# EAGLE design FINAL PROJECT (EAGLE 9.6.2)
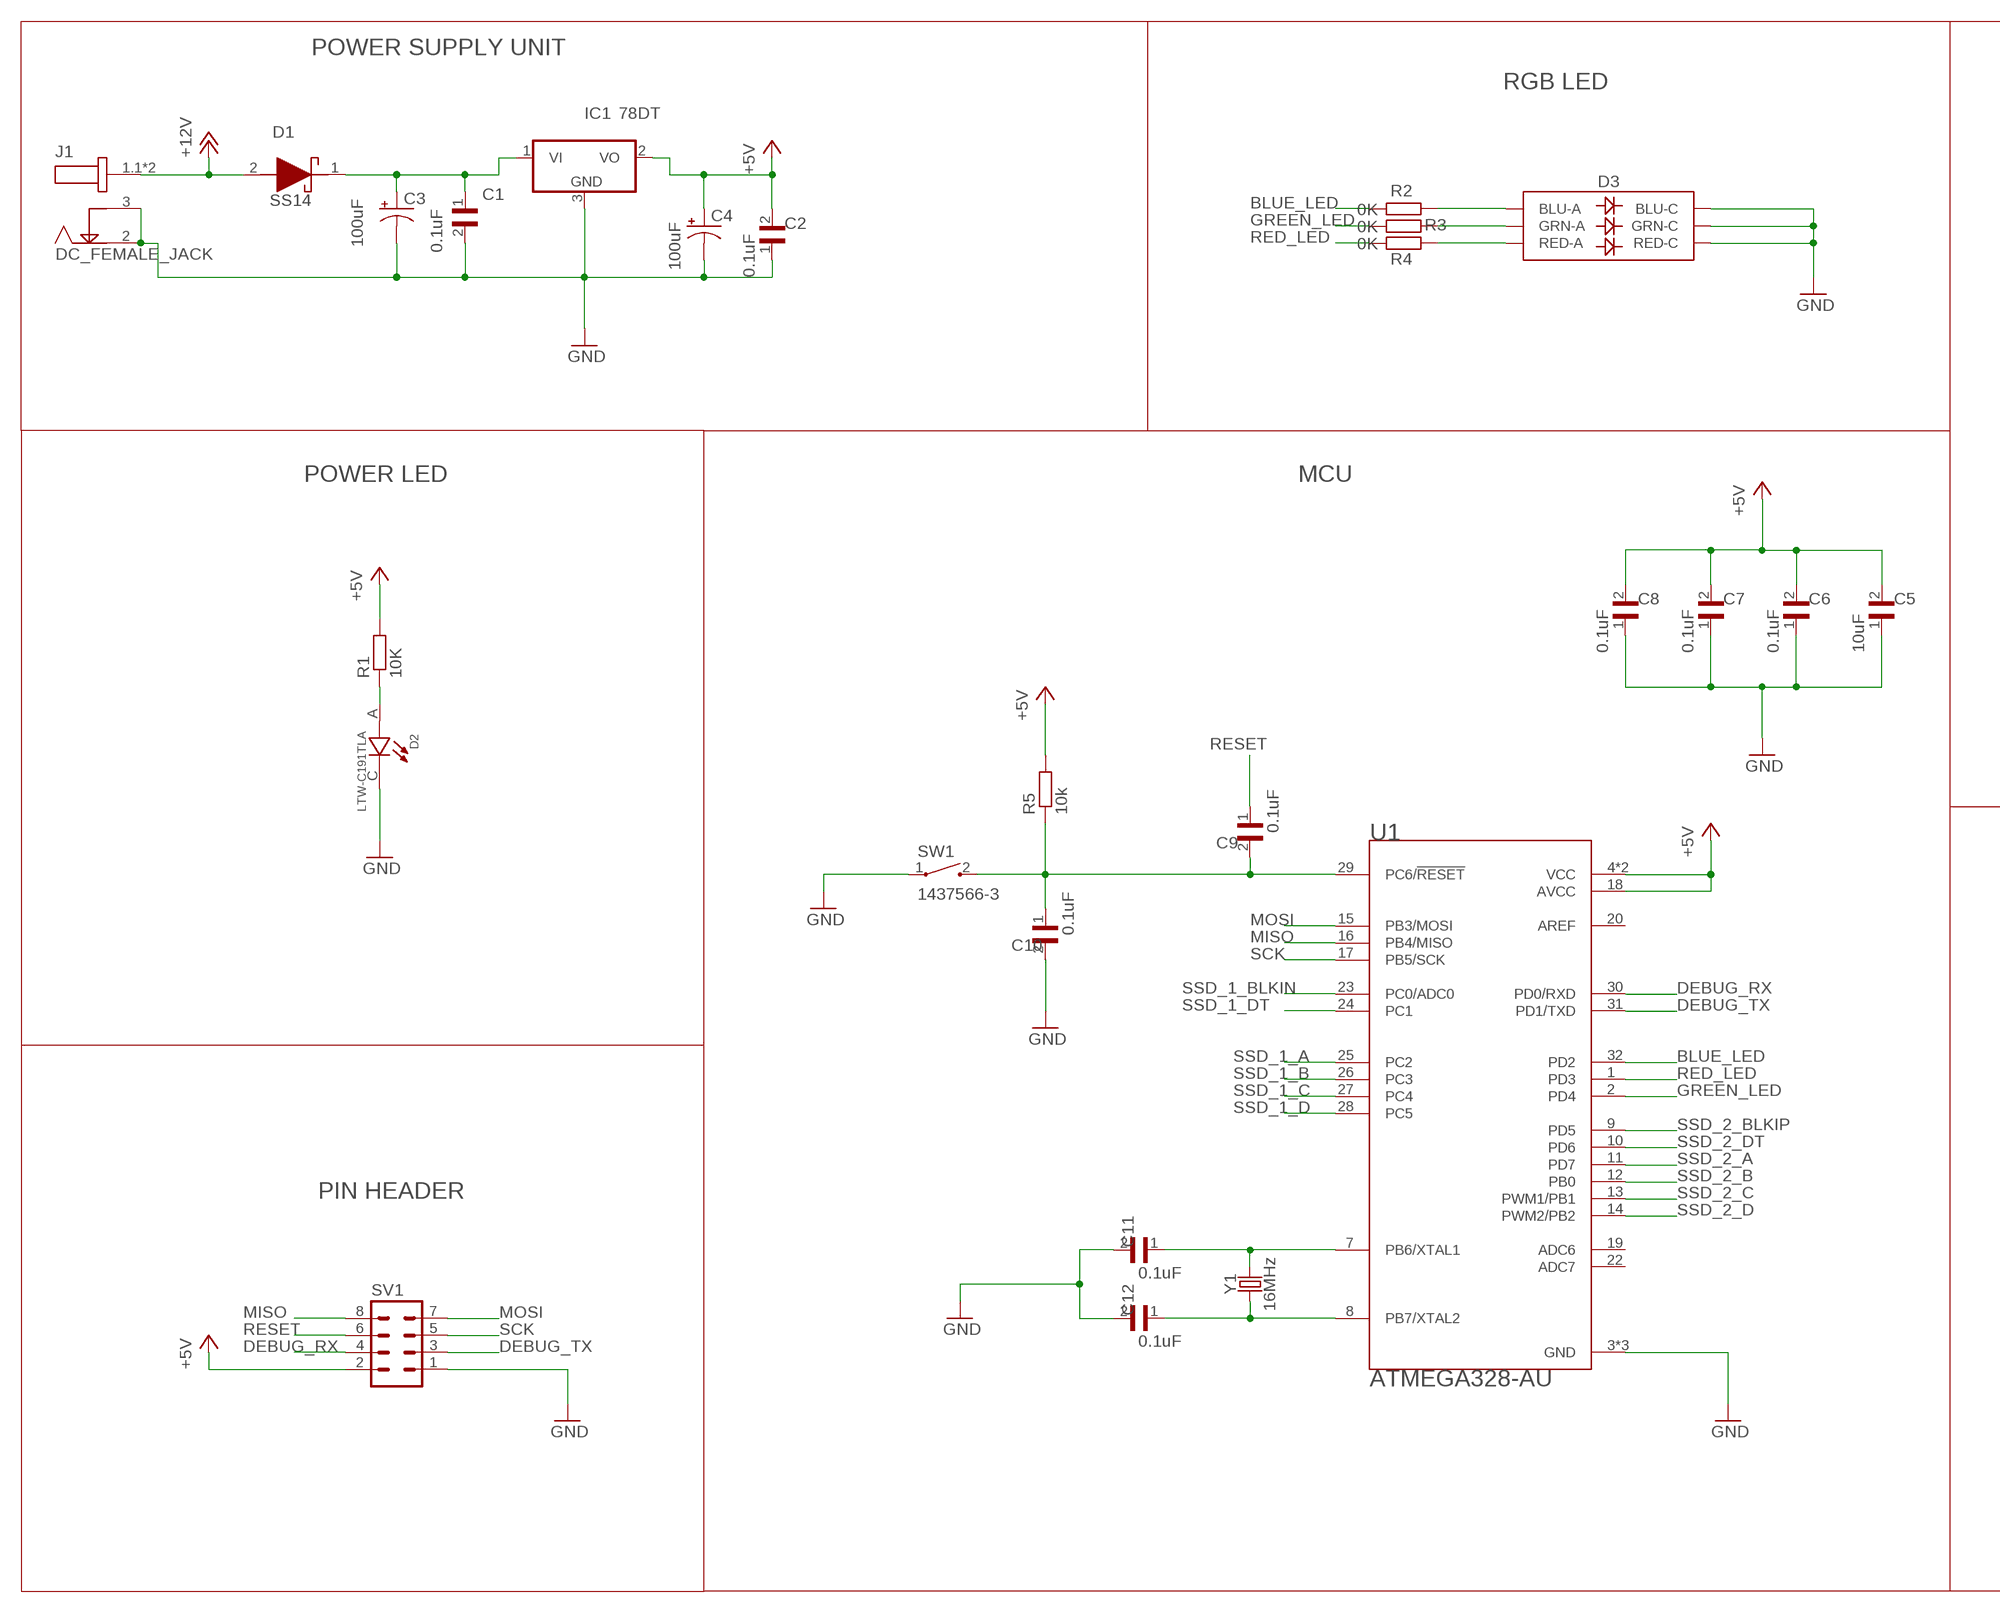
[diagram p0: schematic, sheet 1, part 1 of 2]
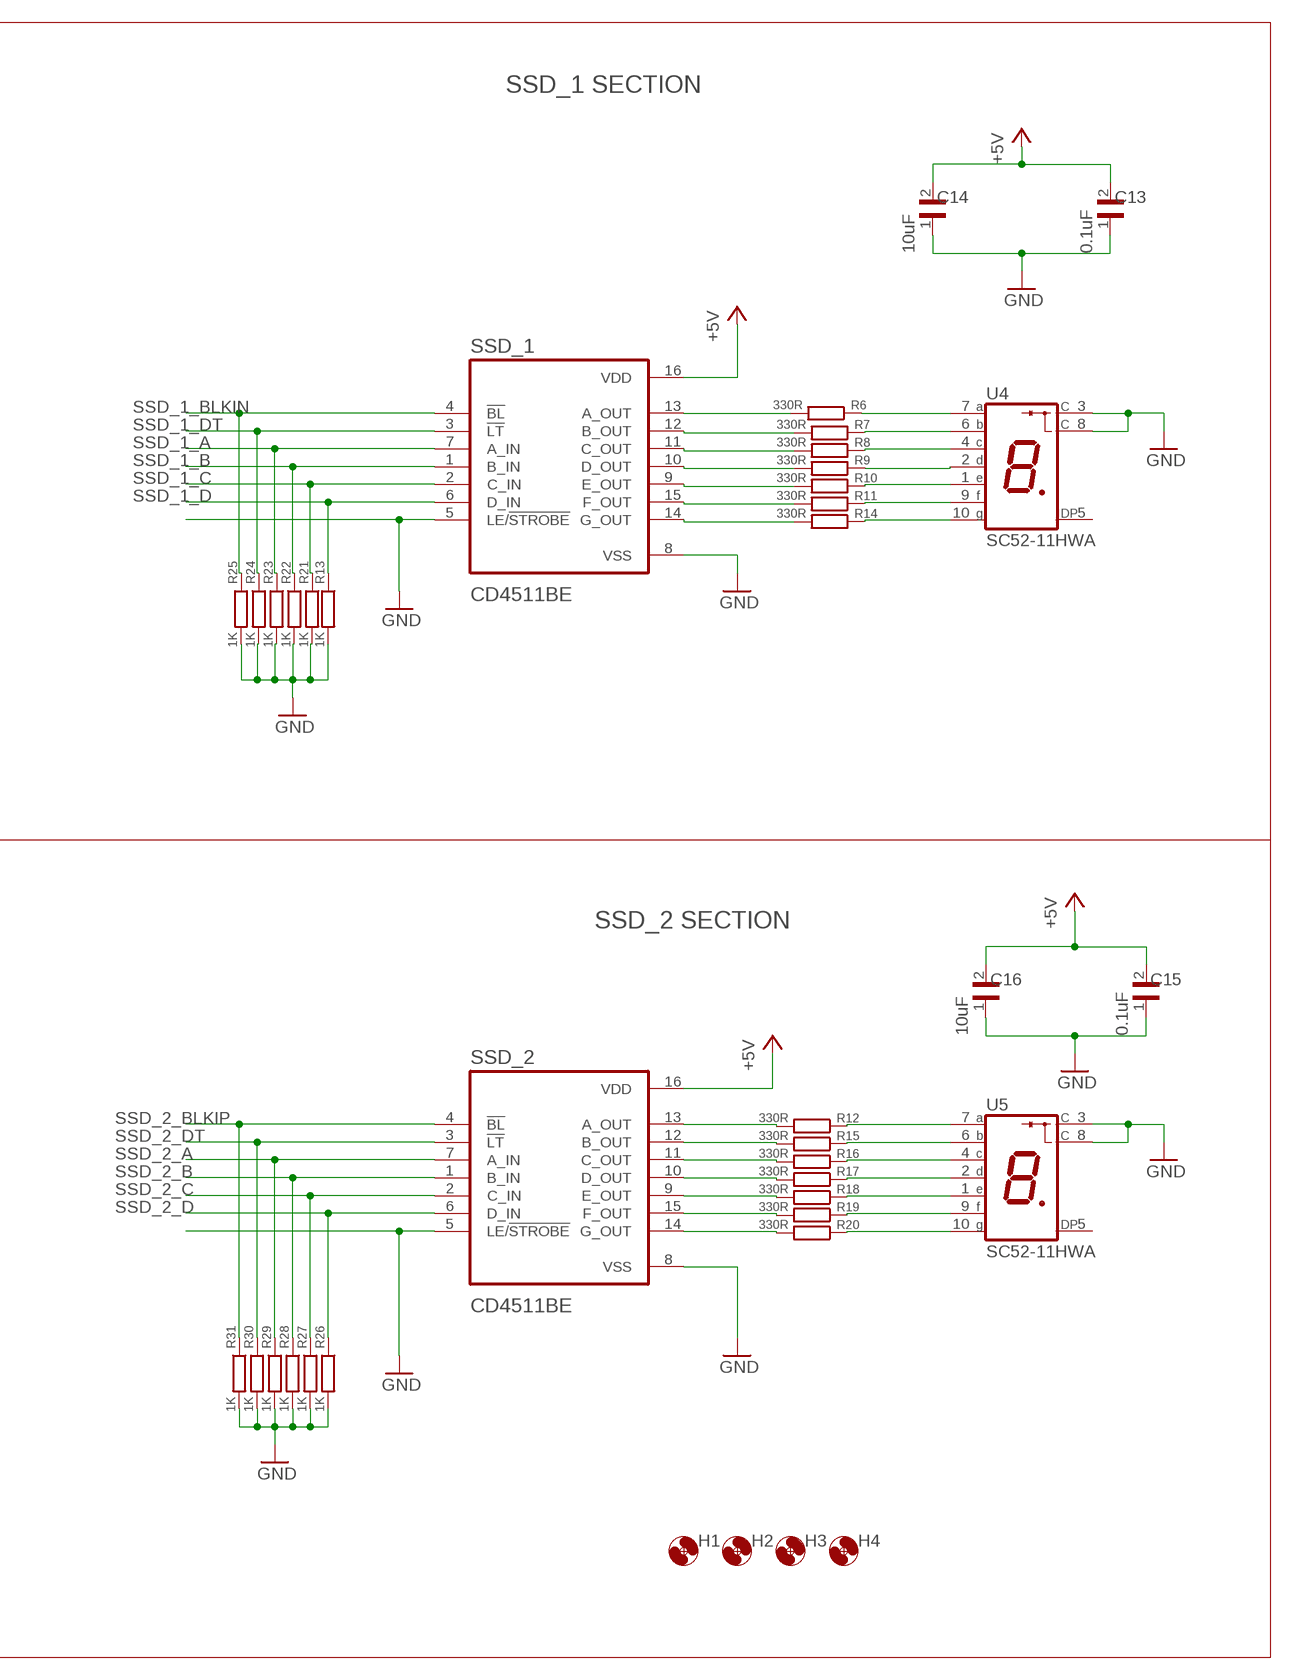
[diagram p1: schematic, sheet 1, part 2 of 2]

## Parts
C1  0.1uF  CAPACITOR  [C0603]
C2  0.1uF  CAPACITOR  [C0603]
C3  100uF  100UF-POLAR-RADIAL-2.5MM-25V-20%  [CPOL-RADIAL-2.5MM-6.5MM]
C4  100uF  100UF-POLAR-RADIAL-2.5MM-25V-20%  [CPOL-RADIAL-2.5MM-6.5MM]
C5  10uF  CAPACITOR  [C0603]
C6  0.1uF  CAPACITOR  [C0603]
C7  0.1uF  CAPACITOR  [C0603]
C8  0.1uF  CAPACITOR  [C0603]
C9  0.1uF  CAPACITOR  [C0603]
C10  0.1uF  CAPACITOR  [C0603]
C11  0.1uF  CAPACITOR  [C0603]
C12  0.1uF  CAPACITOR  [C0603]
C13  0.1uF  CAPACITOR  [C0603]
C14  10uF  CAPACITOR  [C0603]
C15  0.1uF  CAPACITOR  [C0603]
C16  10uF  CAPACITOR  [C0603]
D1  SS14  [DIOM5126X250N]
D2  LTW-C191TLA  [LEDC1608X65N]
D3  LED-RGBNO_IC  [LED-TRICOLOR-5050]
H1  MOUNT-HOLE2.8  [2,8]
H2  MOUNT-HOLE2.8  [2,8]
H3  MOUNT-HOLE2.8  [2,8]
H4  MOUNT-HOLE2.8  [2,8]
IC1  78DT  [TO252]
J1  DC_FEMALE_JACK  DCJ200-05-A-XX-X_REVA  [GCT_DCJ200-05-A-XX-X_REVA]
R1  10K  RESISTOR  [R0603]
R2  0K  RESISTOR  [R0603]
R3  0K  RESISTOR  [R0603]
R4  0K  RESISTOR  [R0603]
R5  10k  RESISTOR  [R0603]
R6  330R  RESISTOR  [R0603]
R7  330R  RESISTOR  [R0603]
R8  330R  RESISTOR  [R0603]
R9  330R  RESISTOR  [R0603]
R10  330R  RESISTOR  [R0603]
R11  330R  RESISTOR  [R0603]
R12  330R  RESISTOR  [R0603]
R13  1K  RESISTOR  [R0603]
R14  330R  RESISTOR  [R0603]
R15  330R  RESISTOR  [R0603]
R16  330R  RESISTOR  [R0603]
R17  330R  RESISTOR  [R0603]
R18  330R  RESISTOR  [R0603]
R19  330R  RESISTOR  [R0603]
R20  330R  RESISTOR  [R0603]
R21  1K  RESISTOR  [R0603]
R22  1K  RESISTOR  [R0603]
R23  1K  RESISTOR  [R0603]
R24  1K  RESISTOR  [R0603]
R25  1K  RESISTOR  [R0603]
R26  1K  RESISTOR  [R0603]
R27  1K  RESISTOR  [R0603]
R28  1K  RESISTOR  [R0603]
R29  1K  RESISTOR  [R0603]
R30  1K  RESISTOR  [R0603]
R31  1K  RESISTOR  [R0603]
SSD_1  CD4511BE  [DIP794W45P254L1969H508Q16]
SSD_2  CD4511BE  [DIP794W45P254L1969H508Q16]
SV1  MA04-2  [MA04-2]
SW1  1437566-3  [SW_1437566-3]
U1  ATMEGA328-AU  [QFP80P900X900X120-32N]
U4  SC52-11HWA  [LED_SC52-11HWA]
U5  SC52-11HWA  [LED_SC52-11HWA]
Y1  16MHz  CRYSTAL-16MHZPTH-HC49US  [HC49US]

## Nets
+5V: C2.2 C4.1(+) C5.2 C6.2 C7.2 C8.2 C13.2 C14.2 C15.2 C16.2 IC1.2(VO) R1.2 R5.2 SSD_1.16(VDD) SSD_2.16(VDD) SV1.2 U1.4(VCC) U1.6(VCC) U1.18(AVCC)
+12V: D1.2(A) J1.1.1 J1.1.2
BLUE_LED: R2.2 U1.32(PD2)
DEBUG_RX: SV1.4 U1.30(PD0/RXD)
DEBUG_TX: SV1.3 U1.31(PD1/TXD)
GND: C1.2 C2.1 C3.2(-) C4.2(-) C5.1 C6.1 C7.1 C8.1 C10.2 C11.2 C12.2 C13.1 C14.1 C15.1 C16.1 D2.C D3.4(BLU-C) D3.5(RED-C) D3.6(GRN-C) IC1.3(GND) J1.2 J1.3 R13.2 R21.2 R22.2 R23.2 R24.2 R25.2 R26.2 R27.2 R28.2 R29.2 R30.2 R31.2 SSD_1.5(LE/!STROBE) SSD_1.8(VSS) SSD_2.5(LE/!STROBE) SSD_2.8(VSS) SV1.1 SW1.1 U1.3(GND) U1.5(GND) U1.21(GND) U4.3(C) U4.8(C) U5.3(C) U5.8(C)
GREEN_LED: R3.2 U1.2(PD4)
MISO: SV1.8 U1.16(PB4/MISO)
MOSI: SV1.7 U1.15(PB3/MOSI)
N$1: C1.1 C3.1(+) D1.1(K) IC1.1(VI)
N$2: D2.A R1.1
N$3: C9.2 C10.1 R5.1 SW1.2 U1.29(PC6/!RESET)
N$4: C11.1 U1.7(PB6/XTAL1) Y1.2
N$5: C12.1 U1.8(PB7/XTAL2) Y1.1
N$6: R6.2 SSD_1.13(A_OUT)
N$7: R7.2 SSD_1.12(B_OUT)
N$8: R8.2 SSD_1.11(C_OUT)
N$9: D3.3(BLU-A) R2.1
N$10: D3.1(GRN-A) R3.1
N$11: D3.2(RED-A) R4.1
N$12: R9.2 SSD_1.10(D_OUT)
N$13: R10.2 SSD_1.9(E_OUT)
N$14: R11.2 SSD_1.15(F_OUT)
N$15: R14.2 SSD_1.14(G_OUT)
N$16: R6.1 U4.7(A)
N$17: R7.1 U4.6(B)
N$18: R8.1 U4.4(C)
N$19: R9.1 U4.2(D)
N$20: R10.1 U4.1(E)
N$21: R11.1 U4.9(F)
N$22: R14.1 U4.10(G)
N$23: R15.1 U5.6(B)
N$24: R16.1 U5.4(C)
N$25: R12.2 SSD_2.13(A_OUT)
N$26: R15.2 SSD_2.12(B_OUT)
N$27: R16.2 SSD_2.11(C_OUT)
N$28: R17.2 SSD_2.10(D_OUT)
N$29: R18.2 SSD_2.9(E_OUT)
N$30: R19.2 SSD_2.15(F_OUT)
N$31: R20.2 SSD_2.14(G_OUT)
N$32: R12.1 U5.7(A)
N$33: R17.1 U5.2(D)
N$34: R18.1 U5.1(E)
N$36: R19.1 U5.9(F)
N$37: R20.1 U5.10(G)
RED_LED: R4.2 U1.1(PD3)
RESET: C9.1 SV1.6
SCK: SV1.5 U1.17(PB5/SCK)
SSD_1_A: R23.1 SSD_1.7(A_IN) U1.25(PC2)
SSD_1_B: R22.1 SSD_1.1(B_IN) U1.26(PC3)
SSD_1_BLKIN: R25.1 SSD_1.4(!BL) U1.23(PC0/ADC0)
SSD_1_C: R21.1 SSD_1.2(C_IN) U1.27(PC4)
SSD_1_D: R13.1 SSD_1.6(D_IN) U1.28(PC5)
SSD_1_DT: R24.1 SSD_1.3(!LT) U1.24(PC1)
SSD_2_A: R29.1 SSD_2.7(A_IN) U1.11(PD7)
SSD_2_B: R28.1 SSD_2.1(B_IN) U1.12(PB0)
SSD_2_BLKIP: R31.1 SSD_2.4(!BL) U1.9(PD5)
SSD_2_C: R27.1 SSD_2.2(C_IN) U1.13(PWM1/PB1)
SSD_2_D: R26.1 SSD_2.6(D_IN) U1.14(PWM2/PB2)
SSD_2_DT: R30.1 SSD_2.3(!LT) U1.10(PD6)
Unconnected: U1.19(ADC6) U1.20(AREF) U1.22(ADC7) U4.5(DP) U5.5(DP)

## Notes on the sheet
- POWER SUPPLY UNIT
- RGB LED | SSD_1 SECTION
- POWER LED | MCU
- SSD_2 SECTION
- PIN HEADER

## Library data of the parts
C1 = PC_Capacitor_0603:CAPACITOR: CAP CERAMIC, 0.1UF, 50V, X7R, 0603, FULL REEL Check prices <https://pricing.snapeda.com/parts/CGA3E2X7R1H104K080AA/TDK/view-part?ref=eda>; AVAILABILITY: Good; DESCRIPTION: 0.1µF ±10% 50V Ceramic Capacitor X7R 0603 (1608 Metric); MF: TDK; MP: CGA3E2X7R1H104K080AA; PACKAGE: 1608 TDK; PRICE: None; PURCHASE-URL: https://pricing.snapeda.com/search/part/CGA3E2X7R1H104K080AA/?ref=eda
C2 C5-C16 = PC_Capacitor_0603:CAPACITOR: CAP CERAMIC, 0.1UF, 50V, X7R, 0603, FULL REEL Check prices <https://pricing.snapeda.com/parts/CGA3E2X7R1H104K080AA/TDK/view-part?ref=eda>; AVAILABILITY: Good; DESCRIPTION: 0.1µF ±10% 50V Ceramic Capacitor X7R 0603 (1608 Metric); MF: TDK; MP: CGA3E2X7R1H104K080AA; PACKAGE: 1608 TDK; PRICE: None; PURCHASE-URL: https://pricing.snapeda.com/search/part/CGA3E2X7R1H104K080AA/?ref=eda; SPICEPREFIX: C
C3 C4 = SparkFun-Capacitors:100UF-POLAR: 100µF polarized capacitors A capacitor is a passive two-terminal electrical component used to store electrical energy temporarily in an electric field.; PROD_ID: CAP-08439
D1 = SS14:SS14: TAIWAN SEMICONDUCTOR - SS14 - SCHOTTKY RECTIFIER, 1A, 40V, DO-214AC Source: Datasheet <https://www.taiwansemi.com/assets/uploads/datasheet/SS12 SERIES_Q2102.pdf>; ARROW_PART_NUMBER: SS14; ARROW_PRICE-STOCK: https://www.arrow.com/en/products/ss14/taiwan-semiconductor?region=europe; DESCRIPTION: TAIWAN SEMICONDUCTOR - SS14 - SCHOTTKY RECTIFIER, 1A, 40V, DO-214AC; HEIGHT: 2.5mm; MANUFACTURER_NAME: Taiwan Semiconductor; MANUFACTURER_PART_NUMBER: SS14; MOUSER_PART_NUMBER: 821-SS14; MOUSER_PRICE-STOCK: https://www.mouser.co.uk/ProductDetail/Taiwan-Semiconductor/SS14?qs=JV7lzlMm3yLIdi0ESVd3YQ%3D%3D
D2 = PC_LED_0603:LTW-C191TLA: CHIP LED WHITE 0603 TOP VIEW Check prices <https://pricing.snapeda.com/parts/LTW-C191TLA/Lite-On/view-part?ref=eda>; AVAILABILITY: Warning; DESCRIPTION: White LED Indication - Discrete 3.1V 0603 (1608 Metric); MF: Lite-On; MP: LTW-C191TLA; PACKAGE: 0603 Lite-On; PRICE: None; PURCHASE-URL: https://pricing.snapeda.com/search/part/LTW-C191TLA/?ref=eda
D3 = SparkFun-LED:LED-RGB: LED-RGB 6 pin RGB LED (no common connector) Packages: PLCC-6 LED-TRICOLOR-5050 - No built-in IC SparkFun Products: Digital Sandbox <https://www.sparkfun.com/products/12651> LED- SMD RGB <https://www.sparkfun.com/products/10866>; PROD_ID: DIO-10298
H1-H4 = holes:MOUNT-HOLE: MOUNTING HOLE with drill center marker
IC1 = linear 2:78*: Positive VOLTAGE REGULATOR Source: http://cache.national.com/ds/LM/LM78L05.pdf http://www.fairchildsemi.com/ds/LM/LM7805.pdf
J1 = PC_DC_POWER_JACK:DCJ200-05-A-XX-X_REVA: DC Power Jack, SMT, Horizontal, with Locating Pegs, D2.0mm Check prices <https://pricing.snapeda.com/parts/DCJ200-05-A-K1-A/Global%20Connector%20Technology/view-part?ref=eda>; AVAILABILITY: Warning; DESCRIPTION: Power Barrel Connector Jack 2.05mm ID (0.081), 5.50mm OD (0.217) Surface Mount, Right Angle; MF: Global Connector Technology; MP: DCJ200-05-A-K1-A; PACKAGE: None; PRICE: None; PURCHASE-URL: https://pricing.snapeda.com/search/part/DCJ200-05-A-K1-A/?ref=eda
R1-R31 = PC_Resistor_0603:RESISTOR; MF: Yageo; RESISTOR: 0603
SSD_1 SSD_2 = PC_IC_CD4511BE:CD4511BE: None Check availability <https://pricing.snapeda.com/parts/CD4511BE/Texas%20Instruments/view-part?ref=eda>; AVAILABILITY: In Stock; DESCRIPTION: CMOS BCD-to-7-Segment LED Latch Decoder Drivers 16-PDIP -55 to 125; MF: Texas Instruments; MP: CD4511BE; PACKAGE: PDIP-16 Texas Instruments; PRICE: None; PURCHASE-URL: https://pricing.snapeda.com/search/part/CD4511BE/?ref=eda
SV1 = con-lstb:MA04-2: PIN HEADER; OC_FARNELL: unknown; OC_NEWARK: unknown
SW1 = PC_Switch_1437566-3:1437566-3: Switch Tactile OFF (ON) SPST Rectangular Button Gull Wing 0.05A 12VDC SMD Loose Piece Check prices <https://pricing.snapeda.com/parts/1437566-3/TE%20Connectivity/view-part?ref=eda>; AVAILABILITY: Good; COMMENT: 1437566-3; CONFIGURATION_POLE-THROW: Single Pole - Single Throw; CONTACT_CURRENT_RATING: 50 mA; DESCRIPTION: Tactile Switch SPST-NO Top Actuated Surface Mount; MF: TE Connectivity; MP: 1437566-3; PACKAGE: None; PRICE: None
U1 = pc_ic_ATMEGA328P-AU:ATMEGA328-AU: ATmega Series 20 MHz 32 KB Flash 2 KB SRAM 8-Bit Microcontroller - TQFP-32 Check prices <https://pricing.snapeda.com/parts/ATMEGA328-AU/Microchip/view-part?ref=eda>; AVAILABILITY: In Stock; DESCRIPTION: AVR AVR® ATmega Microcontroller IC 8-Bit 20MHz 32KB (16K x 16) FLASH 32-TQFP (7x7); MF: Microchip; MP: ATMEGA328-AU; PACKAGE: TQFP-32 Microchip; PRICE: None; PURCHASE-URL: https://pricing.snapeda.com/search/part/ATMEGA328-AU/?ref=eda
U4 U5 = PC_LED-7-SegmentDisplay:SC52-11HWA: Display: LED; single 7-segment; 13.2mm; red; 0.9-2.2mcd Check availability <https://pricing.snapeda.com/parts/SC52-11HWA/Kingbright/view-part?ref=eda>; AVAILABILITY: Not in stock; DESCRIPTION: Display: LED; single 7-segment; 13.2mm; red; 0.9-2.2mcd; MF: Kingbright; MP: SC52-11HWA; PACKAGE: None; PRICE: None
Y1 = SparkFun-Clocks:CRYSTAL-16MHZ: 16MHz Crystal Digikey Example <http://www.digikey.com/product-search/en?keywords=535-9122-1-ND> Frequency: 16MHz Frequency Stability: ±50ppm Frequency Tolerance: ±20ppm Load Capacitance: 18pF SparkFun Products: Pro Micro -5V/16MHz <https://www.sparkfun.com/products/12640> SparkFun Serial Enabled LCD Kit <https://www.sparkfun.com/products/10097>; PROD_ID: XTAL-08181; SF_ID: COM-00536

## Board
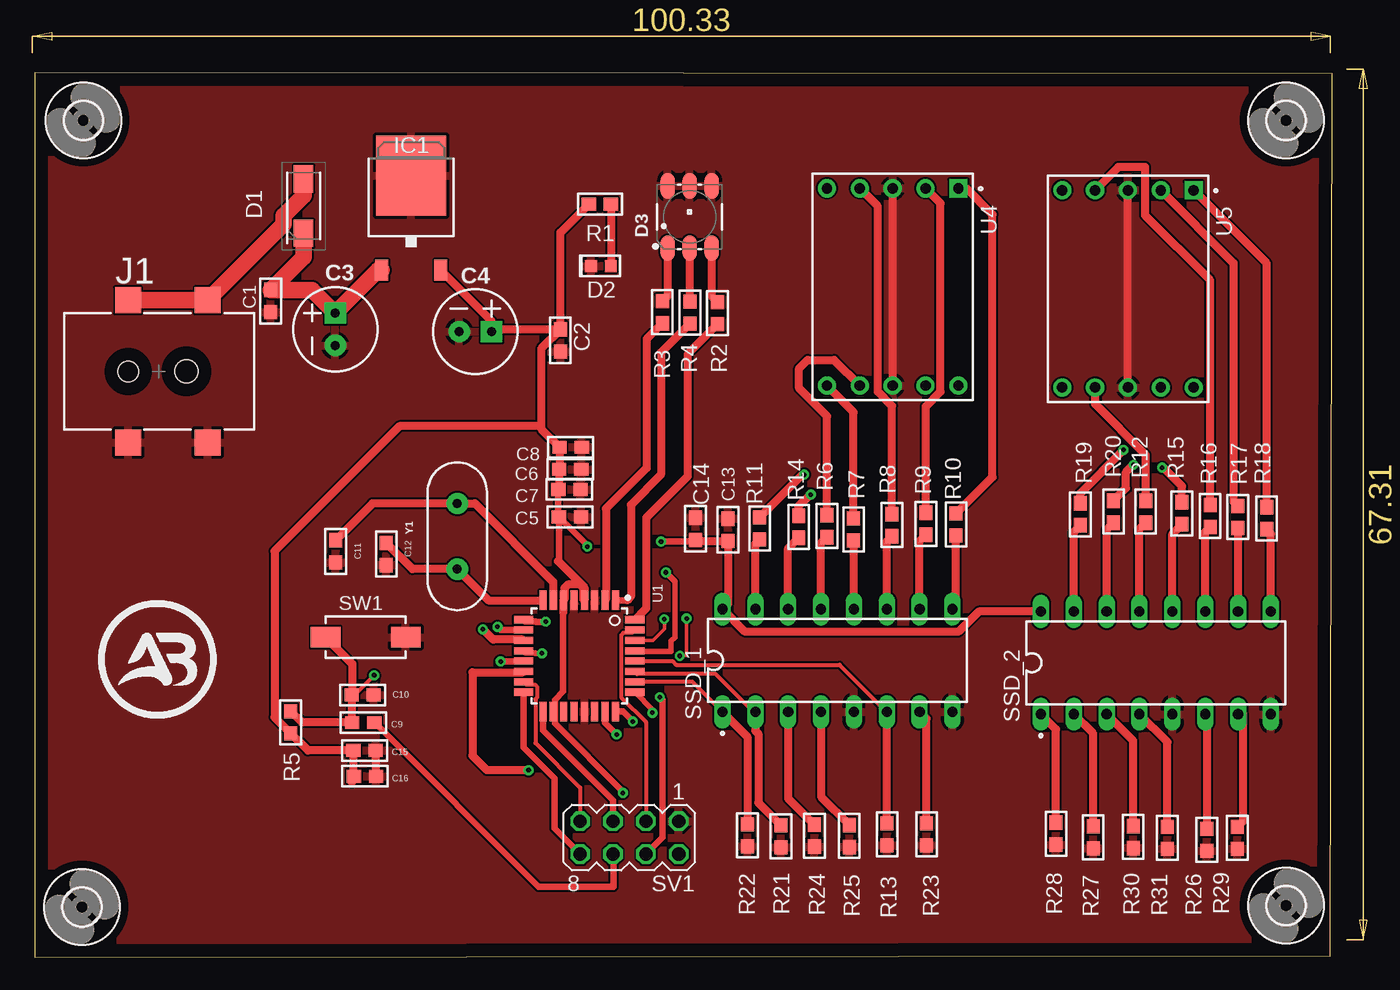
[diagram p2: board, top side]
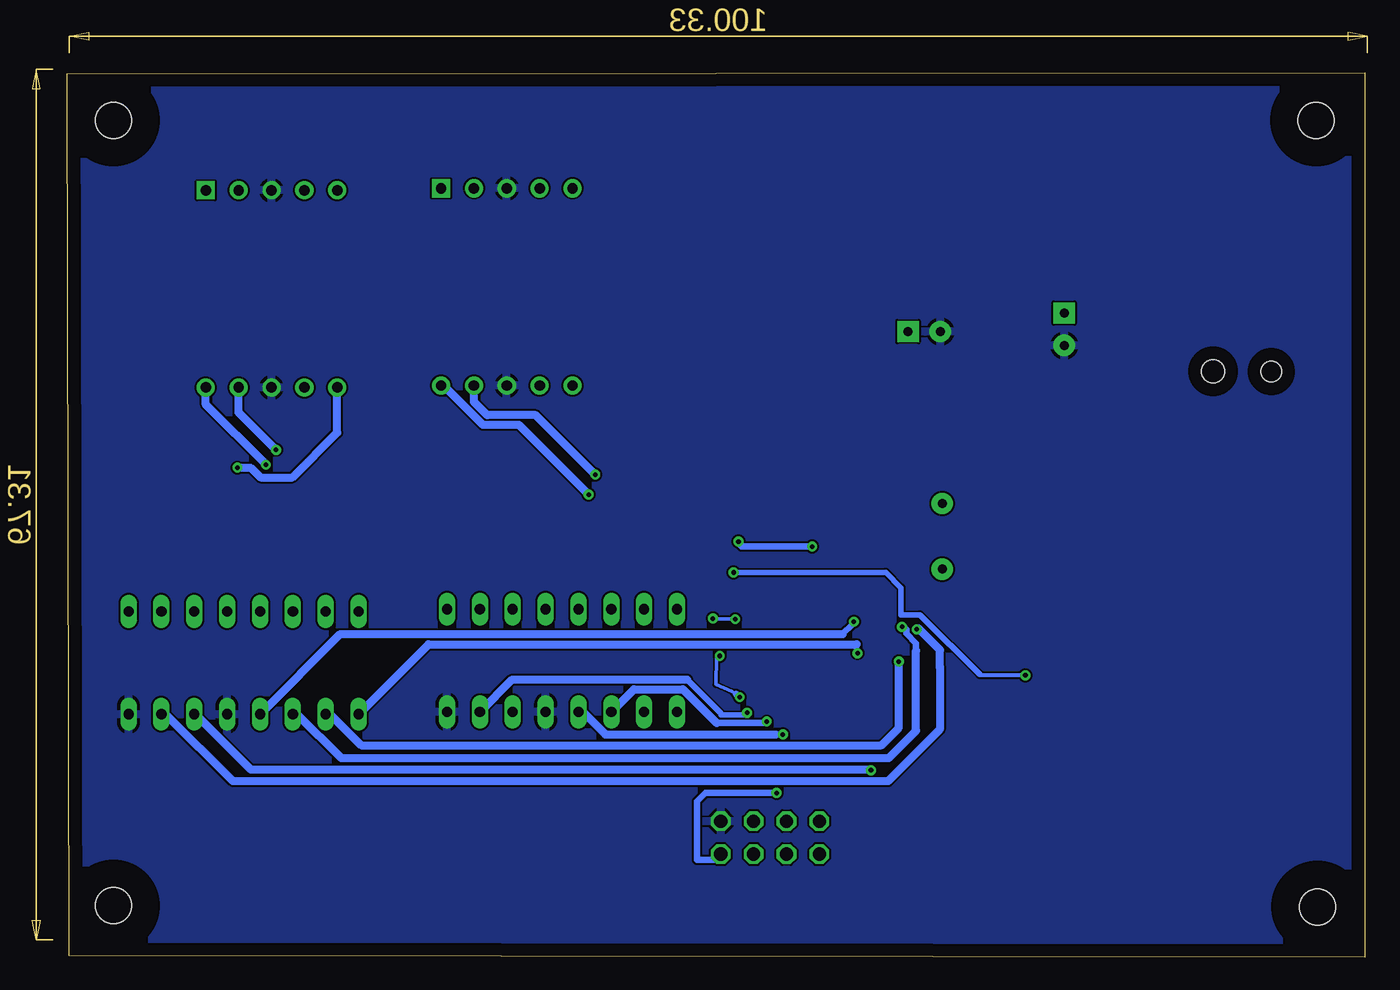
[diagram p3: board, bottom side, seen from below]

Size 100.28 x 68.39 mm. Coordinates in mm from the lower left corner, seen from the top.
Outline: 0,0 100.15,0.13 100.28,68.29 0,68.39 0,0
Copper layers (1*16): Top 0.035mm / dielectric 1.5mm / Bottom 0.035mm
Design rules "default": minimum track width 6mil, minimum drill 0.35mm, track to track 6mil, track to pad 6mil, pad to pad 6mil, via to via 6mil, smd to smd 6mil, copper to edge 40mil, drill to drill 6mil, minimum pad ring 10mil, minimum via ring 8mil, stop-mask expansion 4mil, vias tented up to drill 0mil, thermal gap 10mil

### Footprints (pad centres in the part's own frame; a part is rotated, then mirrored left to right if it is on the bottom)
C0603 = smd 1.1 x 1: 1 -0.909,0; 2 0.809,0
CPOL-RADIAL-2.5MM-6.5MM = drill 0.7 pad 1.651 square: 1 1.25,0 | drill 0.7 pad 1.651: 2 -1.25,0
DIOM5126X250N = smd 2.1 x 1.5: 1 -2.1,0; 2 2.1,0
LEDC1608X65N = smd 0.91 x 0.93: A 0.76,0; C -0.76,0
LED-TRICOLOR-5050 = smd 2 x 1.1: 1 -2.4,1.7; 2 -2.4,0; 3 -2.4,-1.7; 4 2.4,-1.7; 5 2.4,0; 6 2.4,1.7
2,8 = hole 2.8: 0,0
TO252 = smd 1 x 1.6: 1 -2.28,-4.8; 2 2.28,-4.8 | smd 5.4 x 6.2: 3 0,2.5
GCT_DCJ200-05-A-XX-X_REVA = smd 2 x 2: 1.1 -5.5,3.8; 1.2 -5.5,-2.35; 2 5.5,-2.35; 3 5.5,3.8 | hole 1.8: 0,2.15 | hole 1.6: 0,-2.35
R0603 = smd 1.1 x 1: 1 -0.85,0; 2 0.85,0
DIP794W45P254L1969H508Q16 = drill 0.78 pad 1.13 long: 1 -3.97,8.89; 2 -3.97,6.35; 3 -3.97,3.81; 4 -3.97,1.27; 5 -3.97,-1.27; 6 -3.97,-3.81; 7 -3.97,-6.35; 8 -3.97,-8.89; 9 3.97,-8.89; 10 3.97,-6.35; 11 3.97,-3.81; 12 3.97,-1.27; 13 3.97,1.27; 14 3.97,3.81; 15 3.97,6.35; 16 3.97,8.89
MA04-2 = drill 1.016 octagon: 1 -3.81,-1.27; 2 -3.81,1.27; 3 -1.27,-1.27; 4 -1.27,1.27; 5 1.27,-1.27; 6 1.27,1.27; 7 3.81,-1.27; 8 3.81,1.27
SW_1437566-3 = smd 2.3 x 1.6: 1 -3.08,0; 2 3.12,0
QFP80P900X900X120-32N = smd 1.5 x 0.55: 1 -4.3,2.8; 2 -4.3,2; 3 -4.3,1.2; 4 -4.3,0.4; 5 -4.3,-0.4; 6 -4.3,-1.2; 7 -4.3,-2; 8 -4.3,-2.8; 17 4.3,-2.8; 18 4.3,-2; 19 4.3,-1.2; 20 4.3,-0.4; 21 4.3,0.4; 22 4.3,1.2; 23 4.3,2; 24 4.3,2.8 | smd 0.55 x 1.5: 9 -2.8,-4.3; 10 -2,-4.3; 11 -1.2,-4.3; 12 -0.4,-4.3; 13 0.4,-4.3; 14 1.2,-4.3; 15 2,-4.3; 16 2.8,-4.3; 25 2.8,4.3; 26 2,4.3; 27 1.2,4.3; 28 0.4,4.3; 29 -0.4,4.3; 30 -1.2,4.3; 31 -2,4.3; 32 -2.8,4.3
LED_SC52-11HWA = drill 0.8 pad 1.4 square: 1 -7.62,5.08 | drill 0.8 pad 1.4: 2 -7.62,2.54; 3 -7.62,0; 4 -7.62,-2.54; 5 -7.62,-5.08; 6 7.62,-5.08; 7 7.62,-2.54; 8 7.62,0; 9 7.62,2.54; 10 7.62,5.08
HC49US = drill 0.7 pad 1.651: 1 -2.54,0; 2 2.54,0

### Placement (x,y rotation side)
C1  18.24,50.67 270 top
C2  40.64,47.73 90 top
C3  23.24,48.54 90 top
C4  34.06,48.36 0 top
C5  41.33,34.04 180 top
C6  41.35,37.72 180 top
C7  41.27,36.17 180 top
C8  41.38,39.42 180 top
C9  25.35,18.14 180 top
C10  25.4,20.27 0 top
C11  23.27,31.32 270 top
C12  27.18,31.11 270 top
C13  53.59,32.99 270 top
C14  51.08,33.07 270 top
C15  25.45,15.98 180 top
C16  25.48,14 180 top
D1  20.78,58.06 90 top
D2  43.76,53.44 0 top
D3  50.62,57.23 90 top
H1  3.66,3.89 0 top
H2  3.76,64.69 0 top
H3  96.72,64.69 0 top
H4  96.72,3.99 0 top
IC1  29.11,57.91 0 top
J1  9.58,45.29 270 top
R1  43.69,58.22 180 top
R2  52.78,49.78 270 top
R3  48.51,49.86 270 top
R4  50.65,49.83 270 top
R5  19.79,18.16 270 top
R6  61.24,33.32 270 top
R7  63.3,33.07 270 top
R8  66.27,33.4 270 top
R9  68.88,33.5 270 top
R10  71.22,33.45 270 top
R11  56.03,33.15 270 top
R12  85.88,34.44 270 top
R13  65.89,9.5 270 top
R14  59.05,33.27 270 top
R15  88.67,34.32 270 top
R16  90.86,34.11 270 top
R17  92.99,34.04 270 top
R18  95.22,33.93 270 top
R19  80.82,34.24 270 top
R20  83.39,34.44 270 top
R21  57.68,9.35 270 top
R22  55.09,9.42 270 top
R23  68.94,9.5 270 top
R24  60.27,9.4 270 top
R25  62.97,9.37 270 top
R26  90.6,9.07 270 top
R27  81.81,9.27 270 top
R28  78.94,9.55 270 top
R29  92.96,9.22 270 top
R30  84.91,9.3 270 top
R31  87.55,9.22 270 top
SSD_1  62.05,22.94 90 top
SSD_2  86.66,22.76 90 top
SV1  45.97,9.25 180 top
SW1  25.6,24.74 180 top
U1  42.09,23.29 270 top
U4  66.32,51.82 270 top
U5  84.51,51.66 270 top
Y1  32.66,32.54 90 top

### Tracks (layer width: path | path; a pad name or v marks a point on that pad's centre or on a via)
+5V  (via drill 0.35)
  Top 0.305: 40.47,34.19 40.57,34.09
  Top 0.508: U1.18 40.21,18.87 | 40.21,18.87 40.21,18.07 45.44,12.84 45.44,12.7 v45.47,12.7 | 40.21,18.87 40.21,19.91 40.85,20.55 40.85,26.68 | C5.2 42.7,31.85 42.7,31.75 v42.72,31.75 | v48.41,32.13 50.95,32.13 C14.2 | C7.2 40.47,34.09 C5.2 | C5.2 40.52,30.69 40.45,30.62
  Top 0.61: C2.2 40.64,56.02 R1.2 | C2.2 39.15,47.04 39.15,41.05 | 39.15,41.05 39.15,40.84 C8.2 40.57,37.74 C6.2 40.54,36.25 C7.2 | IC1.2 35.31,49.19 C4.1 35.48,48.53 C2.2 | 40.45,30.62 42.49,28.58 U1.4 42.42,27.66 42.42,28.53 42.15,28.8 41.22,28.8 40.96,28.53 40.96,27.66 U1.6 40.85,27.55 40.85,26.68 | C14.2 51.16,32.18 C13.2 53.59,27.34 SSD_1.16 54.91,25.16 71.4,25.16 72.97,26.73 SSD_2.16 | 24.54,13.51 24.54,13.86 C16.2 24.64,14.02 C15.2 21.12,15.98 R5.2 18.54,18.55 18.54,31.39 28.19,41.05 39.15,41.05 | 40.57,34.09 C5.2
  Bottom 0.508: v45.47,12.7 50.95,12.7 51.61,12.04 51.61,7.52 50.24,7.52 SV1.2 | v42.72,31.75 48.18,31.75 48.49,32.05 v48.41,32.13
+12V
  Top 1.27: J1.1.2 J1.1.1 19.24,56.65 19.24,57.34 20.78,58.88 D1.2
BLUE_LED
  Top 0.61: U1.32 47.27,26.97 47.27,33.97 50.47,37.17 50.47,46.62 R2.2
DEBUG_RX  (via drill 0.35)
  Top 0.254: U1.30 47.78,24.49 48.67,25.37 v48.67,26.14 | v50.39,26.19 50.39,23.31 49.89,23.29
  Top 0.305: v49.86,23.29 49.89,23.29
  Top 0.508: v48.31,20.1 48.53,19.88 48.54,19.58 48.54,9.27 SV1.4
  Bottom 0.254: v48.67,26.14 50.24,26.14 50.29,26.19 v50.39,26.19 | v49.86,23.29 49.78,23.4 50.11,23.22 50.16,21.08 48.91,20.54 v48.31,20.1
  Bottom 0.508: 48.62,20.37 v48.32,20.1 v48.31,20.1
DEBUG_TX
  Top 0.305: U1.31 46.17,25.07 45.51,25.07 45.33,24.89 45.33,20.09 47.24,18.18 SV1.3
GND
  Top 0.61: U4.8 U4.3 | U5.8 U5.3 | C15.1 26.36,14.02 C16.1
  pour Top: -0.18,75.01 103.96,75.01 103.96,-2.46 -2.72,-2.46 -2.72,75.01
  pour Bottom: -1.45,73.74 105.23,73.74 105.23,-1.19 -2.72,-1.19 -2.72,73.74
GREEN_LED
  Top 0.61: U1.2 44.16,27.66 44.16,34.68 47.3,37.82 47.3,47.79 R3.2
MISO
  Top 0.508: U1.16 37.79,16.24 40.18,13.84 40.18,9.96 SV1.8
MOSI
  Top 0.305: U1.15 38.01,21.07 38.66,21.07 38.84,20.89 38.84,20.09 38.71,19.96 38.71,16.56 42.16,13.11 SV1.7
N$1
  Top 1.27: D1.1 20.78,54.12 C1.1 21.45,51.58 C3.1 26.56,53.11 IC1.1
N$2
  Top 0.61: R1.1 44.54,53.45 D2.A
N$3  (via drill 0.35)
  Top 0.305: v26.24,21.79 24.76,20.32 24.54,20.32
  Top 0.406: U1.29 46.44,23.64 49.2,23.64 49.2,24.43 49.48,24.71 49.48,29.06 v48.79,29.74
  Top 0.61: SW1.2 24.54,22.68 24.54,20.32 C10.1 24.49,18.18 C9.2 20.66,18.13 R5.1
  Bottom 0.305: 29.77,21.84 29.74,21.82 26.24,21.82 v26.24,21.79
  Bottom 0.406: v48.79,29.74 37.03,29.74 35.84,28.55 35.84,26.47 34.39,26.47 29.77,21.84
N$4
  Top 0.61: U1.7 40.09,29.02 34.04,35.08 Y1.2 26.12,35.08 C11.1
N$5
  Top 0.61: U1.8 35.07,27.59 Y1.1 29.2,30 C12.1
N$6
  Top 0.61: SSD_1.13 60.78,32.02 R6.2
N$7
  Top 0.61: SSD_1.12 63.32,32.2 R7.2
N$8
  Top 0.61: SSD_1.11 65.86,32.14 R8.2
N$9
  Top 0.61: D3.3 52.32,51.09 R2.1
N$10
  Top 0.61: D3.1 48.92,51.12 R3.1
N$11
  Top 0.61: D3.2 50.62,50.71 R4.1
N$12
  Top 0.61: SSD_1.10 68.4,32.17 R9.2
N$13
  Top 0.61: SSD_1.9 71.22,27.18 R10.2
N$14
  Top 0.61: SSD_1.15 55.7,31.97 R11.2
N$15
  Top 0.61: SSD_1.14 58.24,31.61 R14.2
N$16
  Top 0.61: R6.1 61.24,41.83 59.08,43.99 59.08,45.52 59.74,46.18 61.8,46.18 U4.7
N$17
  Top 0.61: R7.1 63.3,42.14 U4.6
N$18
  Top 0.61: R8.1 66.27,42.61 65.16,43.72 65.16,58.05 U4.4
N$19
  Top 0.61: R9.1 68.89,42.59 70.02,43.72 70.02,58.28 U4.2
N$20
  Top 0.61: R10.1 74.04,37.12 74.04,57.4 72.01,59.44 U4.1
N$21  (via drill 0.35)
  Top 0.61: R11.1 59.32,37.29 59.49,37.29 v59.49,37.31
  Bottom 0.61: v59.49,37.31 64.08,41.91 67.84,41.91 68.86,42.93 U4.9
N$22  (via drill 0.35)
  Top 0.61: R14.1 59.05,34.87 59.97,35.79 v60,35.76
  Bottom 0.61: v60,35.76 65.38,41.15 68.16,41.15 71.21,44.2 U4.10
N$23  (via drill 0.35)
  Top 0.61: R15.1 88.67,36.42 87.2,37.9 v87.15,37.85
  Bottom 0.61: v87.15,37.85 86.12,37.85 85.36,37.09 82.89,37.09 79.43,40.55 U5.6
N$24
  Top 0.61: R16.1 90.86,52.32 85.84,57.34 85.84,61.08 83.76,61.08 U5.4
N$25
  Top 0.61: SSD_2.13 85.39,33.11 R12.2
N$26
  Top 0.61: SSD_2.12 87.94,32.73 R15.2
N$27
  Top 0.61: SSD_2.11 90.48,32.88 R16.2
N$28
  Top 0.61: SSD_2.10 93.02,33.16 R17.2
N$29
  Top 0.61: SSD_2.9 95.56,32.75 R18.2
N$30
  Top 0.61: SSD_2.15 80.31,32.88 R19.2
N$31
  Top 0.61: SSD_2.14 82.86,33.06 R20.2
N$32
  Top 0.61: R12.1 85.88,38.84 81.97,42.75 U5.7
N$33
  Top 0.61: R17.1 92.66,35.22 92.66,53.67 U5.2
N$34
  Top 0.61: R18.1 95.22,53.64 U5.1
N$36  (via drill 0.35)
  Top 0.61: R19.1 80.82,35.87 84.15,39.19 v84.15,39.22
  Bottom 0.61: v84.15,39.22 87.05,42.11 U5.9
N$37  (via drill 0.35)
  Top 0.61: R20.1 84.35,36.26 84.35,37.49 v84.94,38.07
  Bottom 0.61: v84.94,38.07 89.59,42.72 U5.10
RED_LED
  Top 0.508: 45.81,27.59 U1.1
  Top 0.61: R4.2 48.41,46.75 48.41,37.3 46.09,34.97 46.09,27.87 45.89,27.67 45.81,27.59
RESET
  Top 0.508: C9.1 38.96,5.44 44.76,5.44 44.76,7.92 SV1.6
SCK
  Top 0.508: U1.17 39.29,17.53 44.7,12.12 SV1.5
SSD_1_A  (via drill 0.35)
  Top 0.406: v47.76,18.89 47.76,19.12 U1.25
  Top 0.61: R23.1 68.94,18.43 SSD_1.7
  Bottom 0.406: 52.39,21.47 49.76,18.84 49.76,18.74 47.9,18.74 v47.76,18.89
  Bottom 0.61: SSD_1.7 65.89,21.47 52.39,21.47
SSD_1_B
  Top 0.305: U1.26 50.84,21.29 SSD_1.1
  Top 0.61: R22.1 55.09,17.04 SSD_1.1 52.87,18.67
SSD_1_BLKIN  (via drill 0.35)
  Top 0.508: v44.98,17.22 44.09,18.12 U1.23
  Top 0.61: SSD_1.4 60.78,12.41 R25.1
  Bottom 0.508: 45.54,17.22 v44.98,17.22
  Bottom 0.61: SSD_1.4 60.44,18.97 58.7,17.22 45.54,17.22
SSD_1_C
  Top 0.305: U1.27 46.59,21.89 52.63,21.89 55.55,18.97 SSD_1.2
  Top 0.61: R21.1 55.93,11.95 55.93,17.27 55.7,17.5 SSD_1.2 55.68,18.97
SSD_1_D
  Top 0.305: U1.28 49.29,22.89 49.58,22.61 62.22,22.61 65.89,18.94
  Top 0.61: R13.1 65.89,18.94 SSD_1.6
SSD_1_DT  (via drill 0.35)
  Top 0.508: v46.24,18.22 45.47,18.99 U1.24
  Top 0.61: SSD_1.3 58.24,12.28 R24.1
  Bottom 0.508: 50.11,18.11 46.25,18.11 46.2,18.16 46.2,18.19 v46.24,18.22
  Bottom 0.61: 50.11,18.11 52.71,20.71 56.5,20.71 SSD_1.3
SSD_2_A  (via drill 0.35)
  Top 0.61: R29.1 93.4,10.5 93.4,18.79 SSD_2.7 | U1.11 37.72,24.56 35.44,24.56 v34.65,25.35
  Bottom 0.61: SSD_2.7 92.68,18.79 87.51,13.62 36.83,13.62 32.85,17.6 32.85,22.43 32.84,22.44 32.84,23.75 34.54,25.45 v34.65,25.35
SSD_2_B  (via drill 0.35)
  Top 0.406: v39.22,23.49 38.71,23.49 38.69,23.52 37.96,23.52 U1.12
  Top 0.61: R28.1 78.94,17.62 SSD_2.1
  Bottom 0.406: 39.29,24.18 39.29,23.49 v39.22,23.49
  Bottom 0.61: SSD_2.1 72.38,24.18 39.29,24.18
SSD_2_BLKIP  (via drill 0.35)
  Top 0.508: v39.5,25.93 38.75,25.93 38.71,25.97 37.91,25.97 U1.9
  Top 0.61: R31.1 87.55,16.63 SSD_2.4
  Bottom 0.508: 40.37,24.98 39.62,25.73 39.62,25.86 39.55,25.93 v39.5,25.93
  Bottom 0.61: SSD_2.4 79.2,24.98 40.37,24.98
SSD_2_C  (via drill 0.35)
  Top 0.508: v36.02,22.86 37.76,22.86 U1.13
  Top 0.61: R27.1 81.81,17.29 SSD_2.2
  Bottom 0.61: SSD_2.2 79.98,18.79 77.57,16.38 37.36,16.38 36.02,17.73 v36.02,22.86
SSD_2_D  (via drill 0.35)
  Top 0.61: SSD_2.6 90.6,18.66 R26.1 | v38.18,14.45 34.96,14.45 33.84,15.57 33.84,22.02 37.72,22.02 U1.14
  Bottom 0.61: SSD_2.6 90.5,18.81 90.5,18.9 86.11,14.5 38.23,14.5 v38.18,14.45
SSD_2_DT  (via drill 0.35)
  Top 0.508: v35.78,25.54 36.02,25.29 U1.10
  Top 0.61: R30.1 84.91,16.73 SSD_2.3
  Bottom 0.508: 34.68,23.71 34.68,24.27 35.43,25.02 35.43,25.32 35.71,25.6 v35.78,25.54
  Bottom 0.61: 34.68,23.71 34.68,17.5 36.79,15.39 79.12,15.39 82.52,18.79 SSD_2.3

### Text on the board
tPlace: C:/Users/DELL/Documents/EAGLE/projects/New_Project/images (11).bmp